# Altium project CS301_Group5.PrjPcb
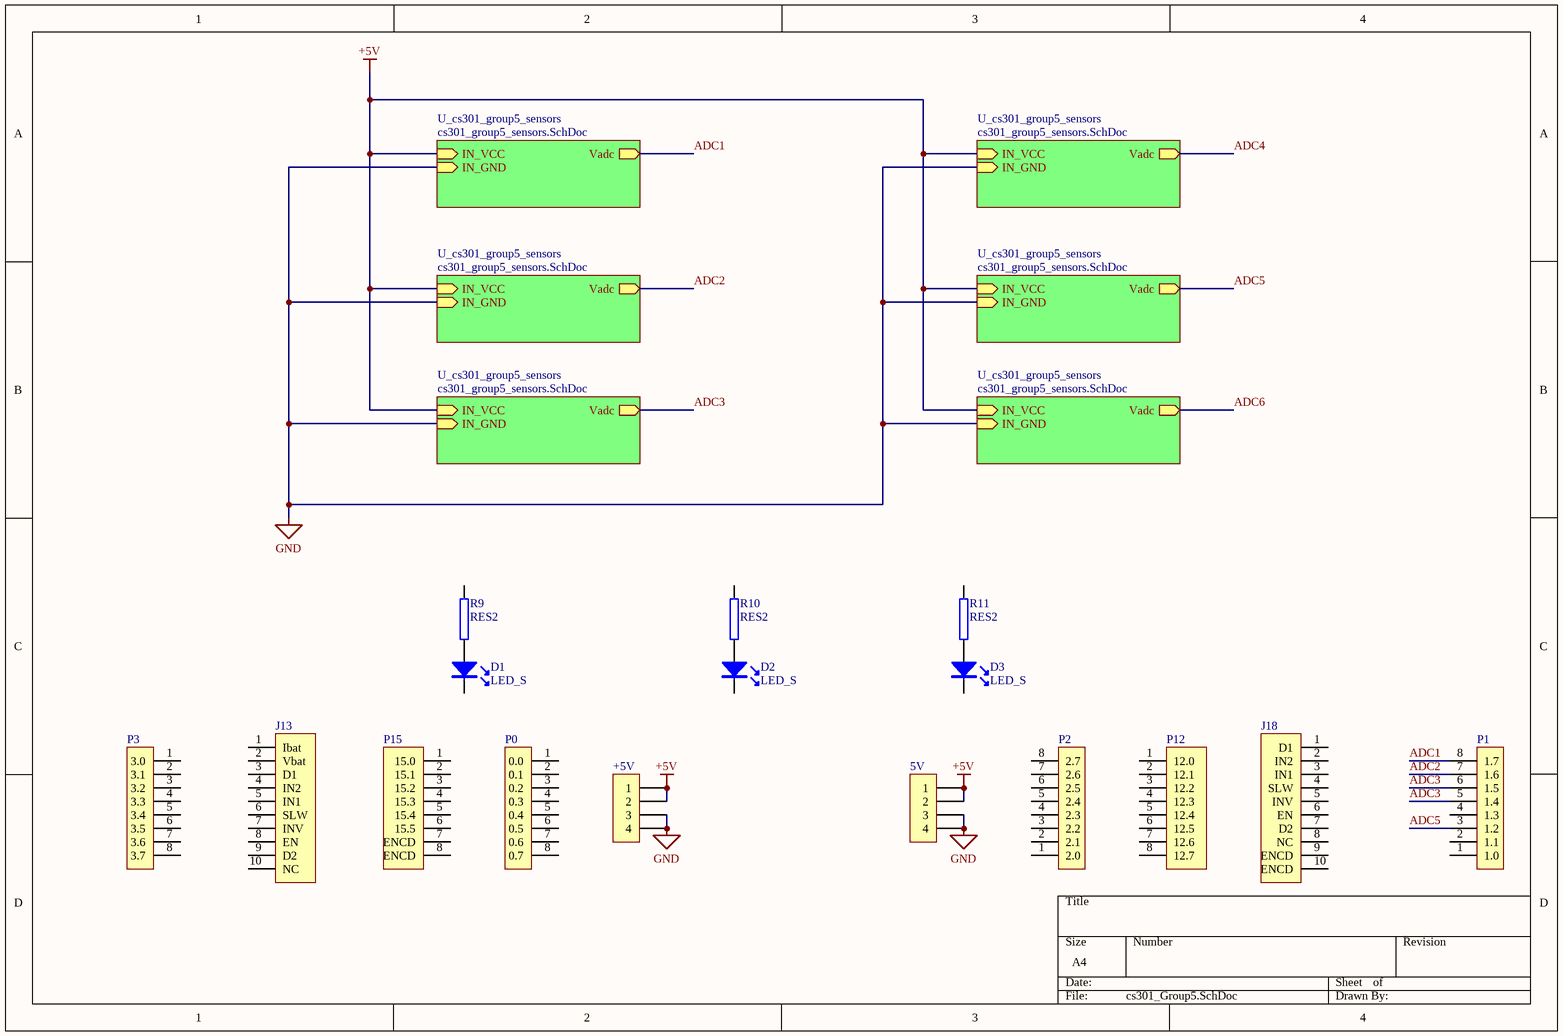
[diagram p0: cs301_Group5.SchDoc]
2 sheets, 100 parts. Net scope: hierarchical (ports join the sheet entries above them; power ports are global).
Board file: cs301_Group5_rev1--4_holes.PcbDoc
Sheets:
  cs301_Group5.SchDoc
    U_cs301_group5_sensors = cs301_group5_sensors.SchDoc
    U_cs301_group5_sensors = cs301_group5_sensors.SchDoc
    U_cs301_group5_sensors = cs301_group5_sensors.SchDoc
    U_cs301_group5_sensors = cs301_group5_sensors.SchDoc
    U_cs301_group5_sensors = cs301_group5_sensors.SchDoc
    U_cs301_group5_sensors = cs301_group5_sensors.SchDoc

## Sheet cs301_Group5.SchDoc: CS301 Sensor PCB
size A4; Author: Group 5; DrawnBy: Group 5; SheetNumber: 1; SheetTotal: 2

### Parts
(Parts that share a designator on the sheet are numbered #1, #2 ... from top to bottom, then left to right.)
5V  5V  [IDC4]  (value not drawn)
+5V  5V  [IDC4]  (value not drawn)
D1#1  LED_S  [LED0.1/5MM]
D2#1  LED_S  [LED0.1/5MM]
D3  LED_S  [LED0.1/5MM]
J13  CON10  [idc10]  (value not drawn)
J18  CON10  [IDC10]  (value not drawn)
P0  P0  [idc8]  (value not drawn)
P1  P1  [idc8]  (value not drawn)
P2  P2  [idc8]  (value not drawn)
P3  P3  [idc8]  (value not drawn)
P12  P12  [idc8]  (value not drawn)
P15  P15  [idc8]  (value not drawn)
R9  RES2  [AXIAL0.4]
R10  RES2  [AXIAL0.4]
R11  RES2  [AXIAL0.4]

### Sub-sheets
U_cs301_group5_sensors = cs301_group5_sensors.SchDoc: Vadc (out), IN_VCC (in), IN_GND (in)
U_cs301_group5_sensors = cs301_group5_sensors.SchDoc: Vadc (out), IN_VCC (in), IN_GND (in)
U_cs301_group5_sensors = cs301_group5_sensors.SchDoc: Vadc (out), IN_VCC (in), IN_GND (in)
U_cs301_group5_sensors = cs301_group5_sensors.SchDoc: Vadc (out), IN_VCC (in), IN_GND (in)
U_cs301_group5_sensors = cs301_group5_sensors.SchDoc: Vadc (out), IN_VCC (in), IN_GND (in)
U_cs301_group5_sensors = cs301_group5_sensors.SchDoc: Vadc (out), IN_VCC (in), IN_GND (in)

### Nets
+5V: 5V.1 5V.2 +5V.1 +5V.2 ; sheet U_cs301_group5_sensors/IN_VCC, sheet U_cs301_group5_sensors/IN_VCC, sheet U_cs301_group5_sensors/IN_VCC, sheet U_cs301_group5_sensors/IN_VCC, sheet U_cs301_group5_sensors/IN_VCC, sheet U_cs301_group5_sensors/IN_VCC  [project net V_VCC]
GND: 5V.3 5V.4 +5V.3 +5V.4 ; sheet U_cs301_group5_sensors/IN_GND, sheet U_cs301_group5_sensors/IN_GND, sheet U_cs301_group5_sensors/IN_GND, sheet U_cs301_group5_sensors/IN_GND, sheet U_cs301_group5_sensors/IN_GND, sheet U_cs301_group5_sensors/IN_GND  [project net V_GND]
ADC1: P1.8(1.7) ; sheet U_cs301_group5_sensors/Vadc
ADC2: P1.7(1.6) ; sheet U_cs301_group5_sensors/Vadc
ADC3: P1.5(1.4) P1.6(1.5) ; sheet U_cs301_group5_sensors/Vadc
ADC5: P1.3(1.2) ; sheet U_cs301_group5_sensors/Vadc
NetD1#1_A: D1#1.A R9.1
NetD2#1_A: D2#1.A R10.1
NetD3_A: D3.A R11.2

Not connected (* = marked no-connect by the designer): D1#1 K(2); D2#1 K(2); D3 K(2); J13 1(Ibat) 2(Vbat) 3(D1) 4(IN2) 5(IN1) 6(SLW) 7(INV) 8(EN) 9(D2) 10(NC); J18 1(D1) 2(IN2) 3(IN1) 4(SLW) 5(INV) 6(EN) 7(D2) 8(NC) 9(ENCD) 10(ENCD); P0 1(0.0) 2(0.1) 3(0.2) 4(0.3) 5(0.4) 6(0.5) 7(0.6) 8(0.7); P1 1(1.0) 2(1.1) 4(1.3); P2 1(2.0) 2(2.1) 3(2.2) 4(2.3) 5(2.4) 6(2.5) 7(2.6) 8(2.7); P3 1(3.0) 2(3.1) 3(3.2) 4(3.3) 5(3.4) 6(3.5) 7(3.6) 8(3.7); P12 1(12.0) 2(12.1) 3(12.2) 4(12.3) 5(12.4) 6(12.5) 7(12.6) 8(12.7); P15 1(15.0) 2(15.1) 3(15.2) 4(15.3) 5(15.4) 6(15.5) 7(ENCD) 8(ENCD); R9 2; R10 2; R11 1

### Library data of the parts
5V +5V = CON4: Connector
D1#1 D2#1 D3 = LED
J13 J18 = CON10: Connector
P0-P3 = CON8: Connector
P12 P15 = CON8_1: Connector

## Sheet cs301_group5_sensors.SchDoc
size A4; SheetNumber: 2; SheetTotal: 2
Used 6 times, as channels U_cs301_group5_sensors, U_cs301_group5_sensors, U_cs301_group5_sensors, U_cs301_group5_sensors, U_cs301_group5_sensors, U_cs301_group5_sensors. Parts and nets are listed once, with the designators drawn on the sheet.
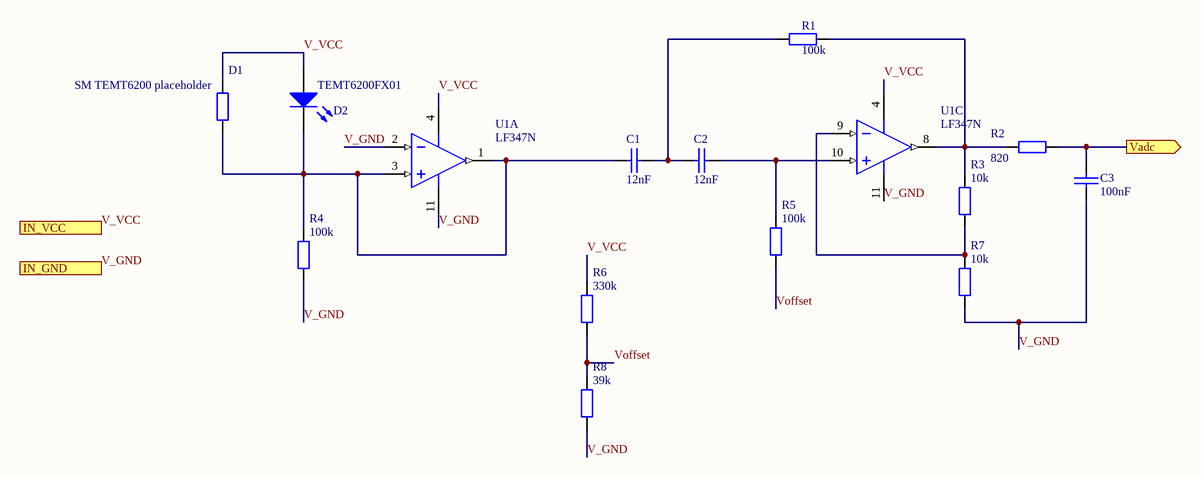
[diagram p1: cs301_group5_sensors.SchDoc]

### Parts
C1  12nF  [CCAP-5P0]
C2  12nF  [CCAP-5P0]
C3  100nF  [CCAP-5P0]
D1  SM TEMT6200 placeholder  [AXIAL-0.4]
D2  TEMT6200FX01  [0805 LED]
R1  100k  [AXIAL-0.4]
R2  820  [AXIAL-0.4]
R3  10k  [AXIAL-0.4]
R4  100k  [AXIAL-0.4]
R5  100k  [AXIAL-0.4]
R6  330k  [AXIAL-0.4]
R7  10k  [AXIAL-0.4]
R8  39k  [AXIAL-0.4]
U1  LF347N  [N0014A]  (parts A,C of 4)

### Ports
IN_GND (in), IN_VCC (in), Vadc (out)

### Nets
V_GND: C3.2 R4.1 R7.1 R8.1 U1.2(IN1-) U1.11(V-) ; port IN_GND
V_VCC: D1.2 D2.1(A) R6.2 U1.4(V+) ; port IN_VCC
Vadc: C3.1 R2.1 ; port Vadc
Voffset: R5.1 R6.1 R8.2
NetC1_1: C1.1 D1.1 D2.2(K) R4.2 U1.1(OUT1) U1.3(IN1+)
NetC1_2: C1.2 C2.1 R1.1
NetC2_2: C2.2 R5.2 U1.10(IN3+)
NetR1_2: R1.2 R2.2 R3.2 U1.8(OUT3)
NetR3_1: R3.1 R7.2 U1.9(IN3-)

### Channels
U_cs301_group5_sensors: designators end in _U_cs301_group5_sensors6; ports IN_GND=V_GND IN_VCC=V_VCC Vadc=ADC1
U_cs301_group5_sensors: designators end in _U_cs301_group5_sensors5; ports IN_GND=V_GND IN_VCC=V_VCC Vadc=ADC2
U_cs301_group5_sensors: designators end in _U_cs301_group5_sensors4; ports IN_GND=V_GND IN_VCC=V_VCC Vadc=ADC3
U_cs301_group5_sensors: designators end in _U_cs301_group5_sensors3; ports IN_GND=V_GND IN_VCC=V_VCC Vadc=ADC4
U_cs301_group5_sensors: designators end in _U_cs301_group5_sensors2; ports IN_GND=V_GND IN_VCC=V_VCC Vadc=ADC5
U_cs301_group5_sensors: designators C1=C1 C2=C2 C3=C3 D1=D1#2 D2=D2#2 R1=R1 R2=R2 R3=R3 R4=R4 R5=R5 R6=R6 R7=R7 R8=R8 U1=U1; ports IN_GND=V_GND IN_VCC=V_VCC Vadc=ADC6

### Library data of the parts
C1-C3 = CerCap_TH_5P0: SMT ceramic capacitor 0805 size; Value: *
D1 = Res_TH_0AX4: Published: 8-Jun-2000; LatestRevisionDate: 17-Jul-2002; LatestRevisionNote: Re-released for DXP Platform.; PackageReference: AXIAL-0.4; Publisher: Altium Limited; Value: *; ComponentLink1Description: http://www.royalohm.com/pdf/product2017/PrecisionMetalMF.pdf
D2 = LED_SMT_0805: SMT LED 0805 size; Manufacturer: Lite-On Inc.; Manufacturer Part Number: LTST-C170KGKT; Color: Green; Lens Color: Colorless; Lens Transparency: Clear; Millicandela Rating: 35mcd; Lens Style/Size: Rectangle with Flat Top, 1.40mm x 1.25mm; Voltage - Forward (Vf) (Typ): 2V; Current - Test: 20mA; Viewing Angle: 130°; Wavelength - Dominant: 571nm; Wavelength - Peak: 574nm; Supplier 1: Digi-Key; RoHS: RoHS Compliant; Category: Optoelectronics; Stock 1: 503069; Pricing 1: 1=0.62, 10=0.459, 25=0.338, 100=0.2415, 250=0.16416, 500=0.14486, 1000=0.11347 (NZD); Packaging: Cut Tape (CT); Part Status: Active; Mounting Type: Surface Mount; Features: -; Package / Case: 0805 (2012 Metric); Size / Dimension: 2.00mm L x 1.25mm W; Height (Max): 1.10mm; ComponentLink1URL: http://optoelectronics.liteon.com/upload/download/DS22-2000-073/LTST-C170KGKT.pdf; ComponentLink1Description: http://optoelectronics.liteon.com/upload/download/DS22-2000-073/LTST-C170KGKT.pdf; Supplier Part Number 1: 160-1414-1-ND; Supplier 2: RSComponents
R1-R8 = Res_TH_0AX4: Through hole resistor; Published: 8-Jun-2000; LatestRevisionDate: 17-Jul-2002; LatestRevisionNote: Re-released for DXP Platform.; PackageReference: AXIAL-0.4; Publisher: Altium Limited; Value: *; ComponentLink1Description: http://www.royalohm.com/pdf/product2017/PrecisionMetalMF.pdf
U1 = CMP-0055-00229-3: Wide Bandwidth Quad JFET Input Operational Amplifier, 14-pin MDIP; Manufacturer: Texas Instruments; PowerWise: N; PackageTopMarking: NSUZXYYTTE#*LF347N; CompType: Amplifiers; RoHS: N; PinCount: 14; Package Reference: N0014A; PackageDescription: MDIP, .750 x .250 x.130in, 14 Lead, .100in Pitch; ComponentLink1Description: Datasheet URL; ComponentLink1URL: http://www.ti.com/general/docs/lit/getliterature.tsp?genericPartNumber=LF347&fileType=pdf; Code_JEDEC: MS-001-AA

## Nets that join several sheets
V_GND: cs301_Group5 (5V.3 5V.4 +5V.3 +5V.4), U_cs301_group5_sensors (6 pins), U_cs301_group5_sensors (6 pins), U_cs301_group5_sensors (6 pins), U_cs301_group5_sensors (6 pins), U_cs301_group5_sensors (6 pins), U_cs301_group5_sensors (6 pins)
V_VCC: cs301_Group5 (5V.1 5V.2 +5V.1 +5V.2), U_cs301_group5_sensors (D1_U_cs301_group5_sensors6.2 D2_U_cs301_group5_sensors6.1 R6_U_cs301_group5_sensors6.2 U1_U_cs301_group5_sensors6.4), U_cs301_group5_sensors (D1_U_cs301_group5_sensors5.2 D2_U_cs301_group5_sensors5.1 R6_U_cs301_group5_sensors5.2 U1_U_cs301_group5_sensors5.4), U_cs301_group5_sensors (D1_U_cs301_group5_sensors4.2 D2_U_cs301_group5_sensors4.1 R6_U_cs301_group5_sensors4.2 U1_U_cs301_group5_sensors4.4), U_cs301_group5_sensors (D1_U_cs301_group5_sensors3.2 D2_U_cs301_group5_sensors3.1 R6_U_cs301_group5_sensors3.2 U1_U_cs301_group5_sensors3.4), U_cs301_group5_sensors (D1_U_cs301_group5_sensors2.2 D2_U_cs301_group5_sensors2.1 R6_U_cs301_group5_sensors2.2 U1_U_cs301_group5_sensors2.4), U_cs301_group5_sensors (D1#2.2 D2#2.1 R6.2 U1.4)
ADC1: cs301_Group5 (P1.8), U_cs301_group5_sensors (C3_U_cs301_group5_sensors6.1 R2_U_cs301_group5_sensors6.1)
ADC2: cs301_Group5 (P1.7), U_cs301_group5_sensors (C3_U_cs301_group5_sensors5.1 R2_U_cs301_group5_sensors5.1)
ADC3: cs301_Group5 (P1.5 P1.6), U_cs301_group5_sensors (C3_U_cs301_group5_sensors4.1 R2_U_cs301_group5_sensors4.1)
ADC5: cs301_Group5 (P1.3), U_cs301_group5_sensors (C3_U_cs301_group5_sensors2.1 R2_U_cs301_group5_sensors2.1)